# Altium schematic sheet ETRX_Shield.SchDoc
size A4; DocumentNumber: 1; SheetNumber: 1; SheetTotal: 4
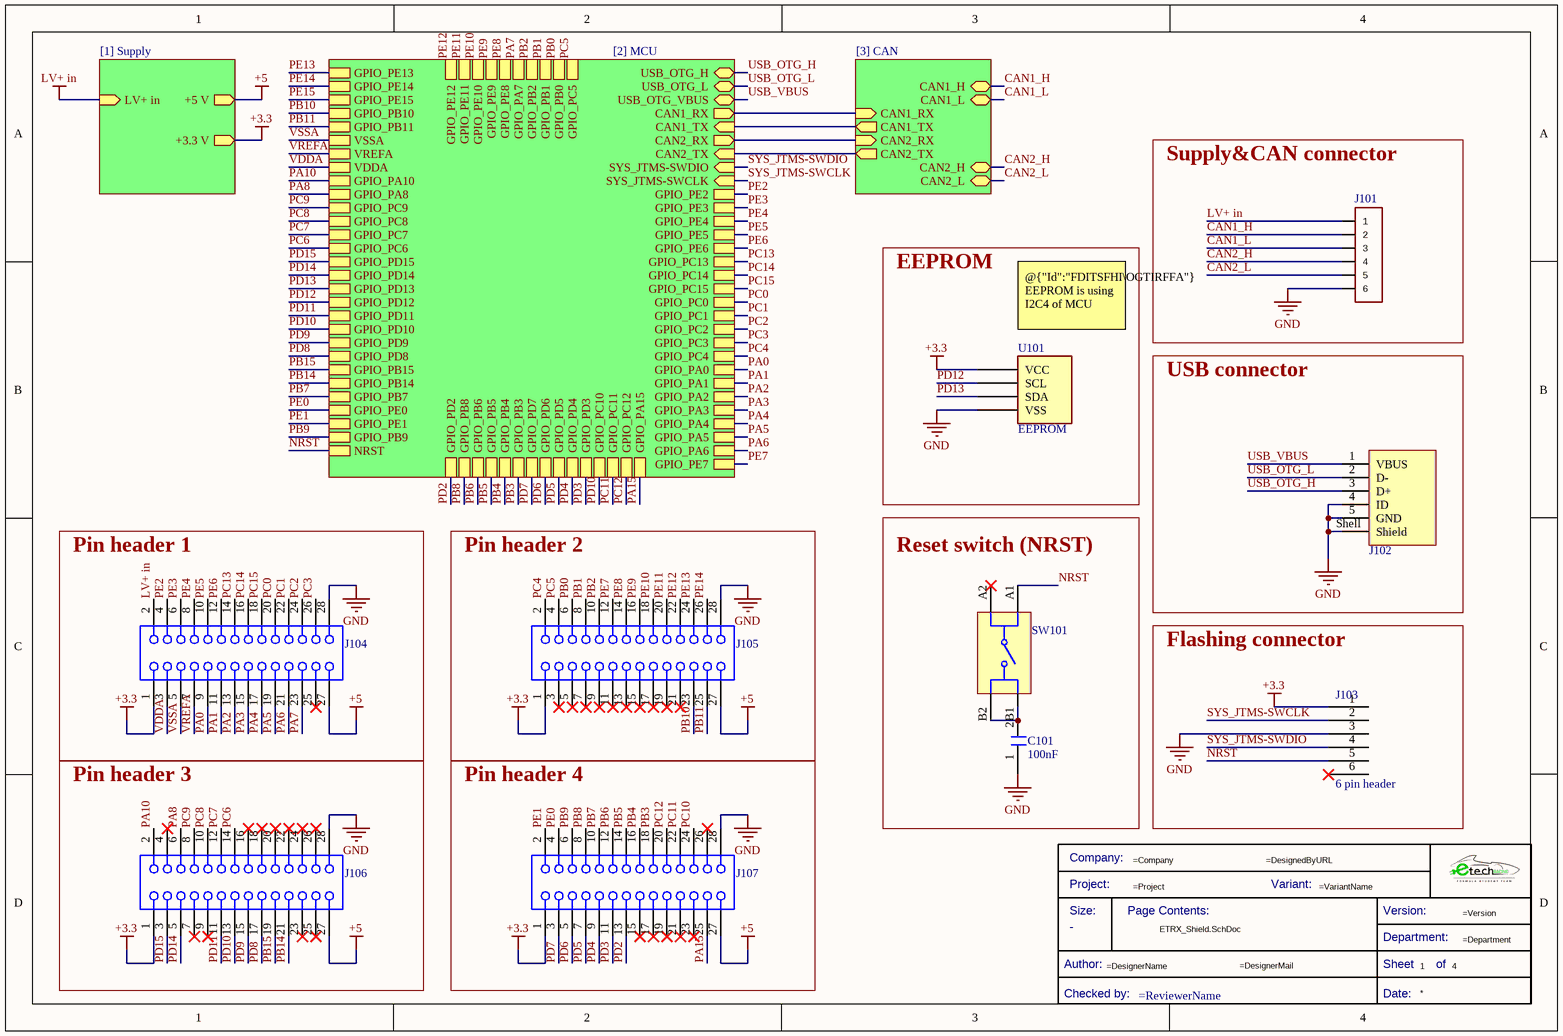
[diagram p0: ETRX_Shield.SchDoc]

## Parts
*  Title Block_template  (value not drawn)  (graphical)
C101  Capacitance: 100nF  [C1206FNPC-RW]  (hidden comment: 885012208058)
J101  LEMO Connector    6 pin EXG.0B.306.HLN Elbow receptacle for printed circuit (solder mount), Female Contact Drawing Rev. 00 Source: http://www.lemo.com/catalog/ROW/UK_English/unipole_multipole.pdf  [EXG.0B.306.HLN]  (value not drawn)
J102  629105136821  [629105136821]  (value not drawn)
J103  6 pin header
J104  62202821821  [62202821821]  (value not drawn)
J105  62202821821  [62202821821]  (value not drawn)
J106  62202821821  [62202821821]  (value not drawn)
J107  62202821821  [62202821821]  (value not drawn)
SW101  430773034825  [WS-TASV_L6W6H3.4_4307x30348xx]  (value not drawn)
U101  EEPROM

## Blocks framed on the sheet
Supply&CAN connector: J101
EEPROM: U101
USB connector: J102
Reset switch (NRST): C101 SW101
Pin header 1: J104
Pin header 2: J105
Flashing connector: J103
Pin header 3: J106
Pin header 4: J107

## Sub-sheets
[1] Supply = [1] Supply: LV+ in (in), +5 V (out), +3.3 V (out)
[2] MCU = [2] MCU: CAN1_RX (out), CAN1_TX (in), CAN2_RX (out), CAN2_TX (in), USB_OTG_H (bidir), USB_OTG_L (bidir), SYS_JTMS-SWDIO (in), SYS_JTMS-SWCLK (in), GPIO_PE2, GPIO_PE3, GPIO_PE4, GPIO_PE5, GPIO_PC13, GPIO_PC14, GPIO_PC15, GPIO_PC0, GPIO_PC1, GPIO_PC2, GPIO_PC3, GPIO_PA0, GPIO_PA1, GPIO_PA2, GPIO_PA3, GPIO_PA4, GPIO_PA5, GPIO_PC4, GPIO_PC5, GPIO_PB0, GPIO_PB1, GPIO_PB2, GPIO_PE8, GPIO_PE9, GPIO_PE10, GPIO_PE11, GPIO_PE12, GPIO_PE13, GPIO_PE14, GPIO_PE15, GPIO_PB10, GPIO_PB11, VSSA, VREFA, VDDA, GPIO_PA8, GPIO_PC9, GPIO_PC8, GPIO_PC7, GPIO_PC6, GPIO_PD15, GPIO_PD14, GPIO_PD13, GPIO_PD12, GPIO_PD11, GPIO_PD10, GPIO_PD9, GPIO_PD8, GPIO_PB15, GPIO_PB14, USB_OTG_VBUS (bidir), GPIO_PB7, GPIO_PE1, GPIO_PE0, GPIO_PB9, GPIO_PB8, GPIO_PB6, GPIO_PB5, GPIO_PB4, GPIO_PB3, GPIO_PD7, GPIO_PD6, GPIO_PD5, GPIO_PD4, GPIO_PD3, GPIO_PD2, GPIO_PC12, GPIO_PC11, GPIO_PC10, GPIO_PA15, GPIO_PA10, GPIO_PE6, GPIO_PA6, GPIO_PA7, GPIO_PE7, NRST
[3] CAN = [3] CAN: CAN1_H (bidir), CAN1_L (bidir), CAN2_H (bidir), CAN2_L (bidir), CAN1_RX (in), CAN2_RX (in), CAN1_TX (out), CAN2_TX (out)

## Nets
+3.3: J103.1 J104.1 J105.1 J106.1 J107.1 U101.1(VCC) ; sheet [1] Supply/+3.3 V
+5: J104.27 J105.27 J106.27 J107.27 ; sheet [1] Supply/+5 V
GND: C101.1 J101.6 J102.4(ID) J102.5(GND) J102.Shell(Shield) J103.3 J104.28 J105.28 J106.28 J107.28 U101.4(VSS)
LV+ in: J101.1 J104.2 ; sheet [1] Supply/LV+ in
CAN1_H: J101.2 ; sheet [3] CAN/CAN1_H
CAN1_L: J101.3 ; sheet [3] CAN/CAN1_L
CAN2_H: J101.4 ; sheet [3] CAN/CAN2_H
CAN2_L: J101.5 ; sheet [3] CAN/CAN2_L
NRST: J103.5 SW101.A1 ; sheet [2] MCU/NRST
PA0: J104.9 ; sheet [2] MCU/GPIO_PA0
PA1: J104.11 ; sheet [2] MCU/GPIO_PA1
PA2: J104.13 ; sheet [2] MCU/GPIO_PA2
PA3: J104.15 ; sheet [2] MCU/GPIO_PA3
PA4: J104.17 ; sheet [2] MCU/GPIO_PA4
PA5: J104.19 ; sheet [2] MCU/GPIO_PA5
PA6: J104.21 ; sheet [2] MCU/GPIO_PA6
PA7: J104.23 ; sheet [2] MCU/GPIO_PA7
PA8: J106.6 ; sheet [2] MCU/GPIO_PA8
PA10: J106.2 ; sheet [2] MCU/GPIO_PA10
PA15: J107.25 ; sheet [2] MCU/GPIO_PA15
PB0: J105.6 ; sheet [2] MCU/GPIO_PB0
PB1: J105.8 ; sheet [2] MCU/GPIO_PB1
PB2: J105.10 ; sheet [2] MCU/GPIO_PB2
PB3: J107.18 ; sheet [2] MCU/GPIO_PB3
PB4: J107.16 ; sheet [2] MCU/GPIO_PB4
PB5: J107.14 ; sheet [2] MCU/GPIO_PB5
PB6: J107.12 ; sheet [2] MCU/GPIO_PB6
PB7: J107.10 ; sheet [2] MCU/GPIO_PB7
PB8: J107.8 ; sheet [2] MCU/GPIO_PB8
PB9: J107.6 ; sheet [2] MCU/GPIO_PB9
PB10: J105.23 ; sheet [2] MCU/GPIO_PB10
PB11: J105.25 ; sheet [2] MCU/GPIO_PB11
PB14: J106.21 ; sheet [2] MCU/GPIO_PB14
PB15: J106.19 ; sheet [2] MCU/GPIO_PB15
PC0: J104.20 ; sheet [2] MCU/GPIO_PC0
PC1: J104.22 ; sheet [2] MCU/GPIO_PC1
PC2: J104.24 ; sheet [2] MCU/GPIO_PC2
PC3: J104.26 ; sheet [2] MCU/GPIO_PC3
PC4: J105.2 ; sheet [2] MCU/GPIO_PC4
PC5: J105.4 ; sheet [2] MCU/GPIO_PC5
PC6: J106.14 ; sheet [2] MCU/GPIO_PC6
PC7: J106.12 ; sheet [2] MCU/GPIO_PC7
PC8: J106.10 ; sheet [2] MCU/GPIO_PC8
PC9: J106.8 ; sheet [2] MCU/GPIO_PC9
PC10: J107.24
PC11: J107.22 ; sheet [2] MCU/GPIO_PC11
PC12: J107.20 ; sheet [2] MCU/GPIO_PC12
PC13: J104.14 ; sheet [2] MCU/GPIO_PC13
PC14: J104.16 ; sheet [2] MCU/GPIO_PC14
PC15: J104.18 ; sheet [2] MCU/GPIO_PC15
PD2: J107.13 ; sheet [2] MCU/GPIO_PD2
PD3: J107.11 ; sheet [2] MCU/GPIO_PD3
PD4: J107.9 ; sheet [2] MCU/GPIO_PD4
PD5: J107.7 ; sheet [2] MCU/GPIO_PD5
PD6: J107.5 ; sheet [2] MCU/GPIO_PD6
PD7: J107.3 ; sheet [2] MCU/GPIO_PD7
PD8: J106.17 ; sheet [2] MCU/GPIO_PD8
PD9: J106.15 ; sheet [2] MCU/GPIO_PD9
PD10: J106.13 ; sheet [2] MCU/GPIO_PD10, sheet [2] MCU/GPIO_PC10
PD11: J106.11 ; sheet [2] MCU/GPIO_PD11
PD12: U101.2(SCL) ; sheet [2] MCU/GPIO_PD12
PD13: U101.3(SDA) ; sheet [2] MCU/GPIO_PD13
PD14: J106.5 ; sheet [2] MCU/GPIO_PD14
PD15: J106.3 ; sheet [2] MCU/GPIO_PD15
PE0: J107.4 ; sheet [2] MCU/GPIO_PE0
PE1: J107.2 ; sheet [2] MCU/GPIO_PE1
PE2: J104.4 ; sheet [2] MCU/GPIO_PE2
PE3: J104.6 ; sheet [2] MCU/GPIO_PE3
PE4: J104.8 ; sheet [2] MCU/GPIO_PE4
PE5: J104.10 ; sheet [2] MCU/GPIO_PE5
PE6: J104.12 ; sheet [2] MCU/GPIO_PE6
PE7: J105.12 ; sheet [2] MCU/GPIO_PE7
PE8: J105.14 ; sheet [2] MCU/GPIO_PE8
PE9: J105.16 ; sheet [2] MCU/GPIO_PE9
PE10: J105.18 ; sheet [2] MCU/GPIO_PE10
PE11: J105.20 ; sheet [2] MCU/GPIO_PE11
PE12: J105.22 ; sheet [2] MCU/GPIO_PE12
PE13: J105.24 ; sheet [2] MCU/GPIO_PE13
PE14: J105.26 ; sheet [2] MCU/GPIO_PE14
PE15: sheet [2] MCU/GPIO_PE15
SYS_JTMS-SWCLK: J103.2 ; sheet [2] MCU/SYS_JTMS-SWCLK
SYS_JTMS-SWDIO: J103.4 ; sheet [2] MCU/SYS_JTMS-SWDIO
USB_OTG_H: J102.3(D+) ; sheet [2] MCU/USB_OTG_H
USB_OTG_L: J102.2(D-) ; sheet [2] MCU/USB_OTG_L
USB_VBUS: J102.1(VBUS) ; sheet [2] MCU/USB_OTG_VBUS
VDDA: J104.3 ; sheet [2] MCU/VDDA
VREFA: J104.7 ; sheet [2] MCU/VREFA
VSSA: J104.5 ; sheet [2] MCU/VSSA
NetC101_2: C101.2 SW101.B1 SW101.B2
(unnamed): sheet [2] MCU/CAN1_RX, sheet [3] CAN/CAN1_RX
(unnamed): sheet [2] MCU/CAN1_TX, sheet [3] CAN/CAN1_TX
(unnamed): sheet [2] MCU/CAN2_RX, sheet [3] CAN/CAN2_RX
(unnamed): sheet [2] MCU/CAN2_TX, sheet [3] CAN/CAN2_TX

Not connected (* = marked no-connect by the designer): J103 6*; J104 25*; J105 3* 5* 7* 9* 11* 13* 15* 17* 19* 21*; J106 4* 7* 9* 16* 18* 20* 22* 23* 24* 25* 26*; J107 15* 17* 19* 21* 23* 26*; SW101 A2*

## Notes on the sheet
- (near U101) @{"Id":"FDITSFHI\OGTIRFFA"} EEPROM is using I2C4 of MCU
- (in symbol Title Block_template) Company:; Project:; Variant:; Size:; Page Contents:; Version:; Department:; Author:; Sheet; of; Checked by:; Date:

## Library data of the parts
* = Title Block_template: Standard Title Block; .Creator: GP; Category: Title Block; .PCBcheck: GP; .SCHcheck: GP; Checked by:: =ReviewerName; Size: -
C101 = C100n-25V-1206FNPC-X7R: Cap Cer 0.1UF 25V X7R 1206; Manufacturer: Wurth Electronics; Tolerance: 10%; .Creator: DO; Category: Capacitor; ComponentLink1Description: Datasheet; ComponentLink1URL: https://www.we-online.com/catalog/datasheet/885012208058.pdf; ComponentLink2Description: Where buy it; ComponentLink2URL: https://www.we-online.com/catalog/en/WCAP-CSGP-25VDC#885012208058; Supplier 1: Digi-Key; Manufacturer Part Number: 885012208058; RoHS: Yes; Stock 1: 4375; Pricing 1: 1=0,11000, 10=0,10100, 100=0,09100, 500=0,08000 (USD); Mount: Surface Mount; Case/Package: 1206; Case Code (Metric): 3216; Case Code (Imperial): 1206; Min Operating Temperature: -55°C; Max Operating Temperature: 125°C; Packaging: Tape and Reel; Voltage Rating: 25V; Length: 0.126inch; Width: 0.063inch; Thickness: 0.035inch; RoHS Compliant: Yes; ComponentLink3URL: https://katalog.we-online.de/pbs/datasheet/885012208058.pdf?src-supplier=Digi-Key; ComponentLink3Description: https://katalog.we-online.de/pbs/datasheet/885012208058.pdf?src-supplier=Digi-Key; Supplier Part Number 1: 732-8109-1-ND
J101 = EXG.0B.306.HLN: MPN: EXG.0B.306.HLN; OC_FARNELL: unknown; OC_NEWARK: unknown
J102 = 629105136821: WR-COM Micro USB 2.0 SMT Type B Horizontal 5 Contacts; Manufacturer: Wurth Elektronik; Match Code: WR-USB; Gender: Receptacle; Interface Type: Type B; Number of Ports: 1; Rated Current: 1A; Working Voltage: 30V (AC); Manufacturer Part Number: 629105136821; Category: Input/Output Connectors; ComponentLink1Description: Website Link; ComponentLink1URL: https://www.we-online.com/redexpert/article/629105136821?ad; ComponentLink2Description: Datasheet Link; ComponentLink2URL: https://www.we-online.com/redexpert/spec/629105136821?ad; Mount: Surface Mount; Operating Temperature Max: 105°C; Operating Temperature Min: -40°C; Packaging: Tape and Reel; Application: Micro USB 2.0; Number of Pins: 5; Orientation: Horizontal
J104-J107 = 62202821821: WR-PHD Socket Header, THT, Vertical, pitch 1.27mm, 2 Row, 28P; Manufacturer: Wurth Elektronik; Contact Resistance: 20mΩ; Rated Current: 1A; Working Voltage: 250V; Withstanding Voltage: 500V; ComponentLink1Description: Website Link; ComponentLink1URL: https://www.we-online.com/redexpert/article/62202821821?ad; ComponentLink2Description: Datasheet Link; ComponentLink2URL: https://www.we-online.com/redexpert/spec/62202821821?ad; Manufacturer Part Number: 62202821821; Category: Board-to-Board Connectors; Match Code: WR-PHD; Mount: Through Hole; Operating Temperature Max: 105°C; Operating Temperature Min: -40°C; Packaging: Tube; Gender: Socket Header; Number of Pins: 28; Number of Rows: 2; Orientation: Vertical; Pitch: 1.27mm
SW101 = 430773034825: WS-TASV J-Hook SMT Hermetic Tact Switch, L6 x W6 x H3.4mm, 250g, SPST-NO, 12V, 50mA; Manufacturer: Wurth Elektronik; Washable: Yes; Manufacturer Part Number: 430773034825; Category: Tact Switches; Match Code: WS-TASV; ComponentLink1Description: Website Link; ComponentLink1URL: https://www.we-online.com/redexpert/article/430773034825?ad; ComponentLink2Description: Datasheet Link; ComponentLink2URL: https://www.we-online.com/redexpert/spec/430773034825?ad; Mount: Surface Mount; Operating Temperature Max: 85°C; Operating Temperature Min: -40°C; Packaging: Tape and Reel; Length: 6mm; Width: 6mm; Height: 3.4mm; Circuit: SPST-NO; Contact Material: Stainless Steel; Contact Plating: Silver; Operation Force: 250g; Rated Current: 50mA; Rated Voltage (DC): 12V; Terminal Material: Copper Alloy; Terminal Plating: Silver
U101 = I2C_EEPROM